# EAGLE design SalinityExpansion (EAGLE 6.4)
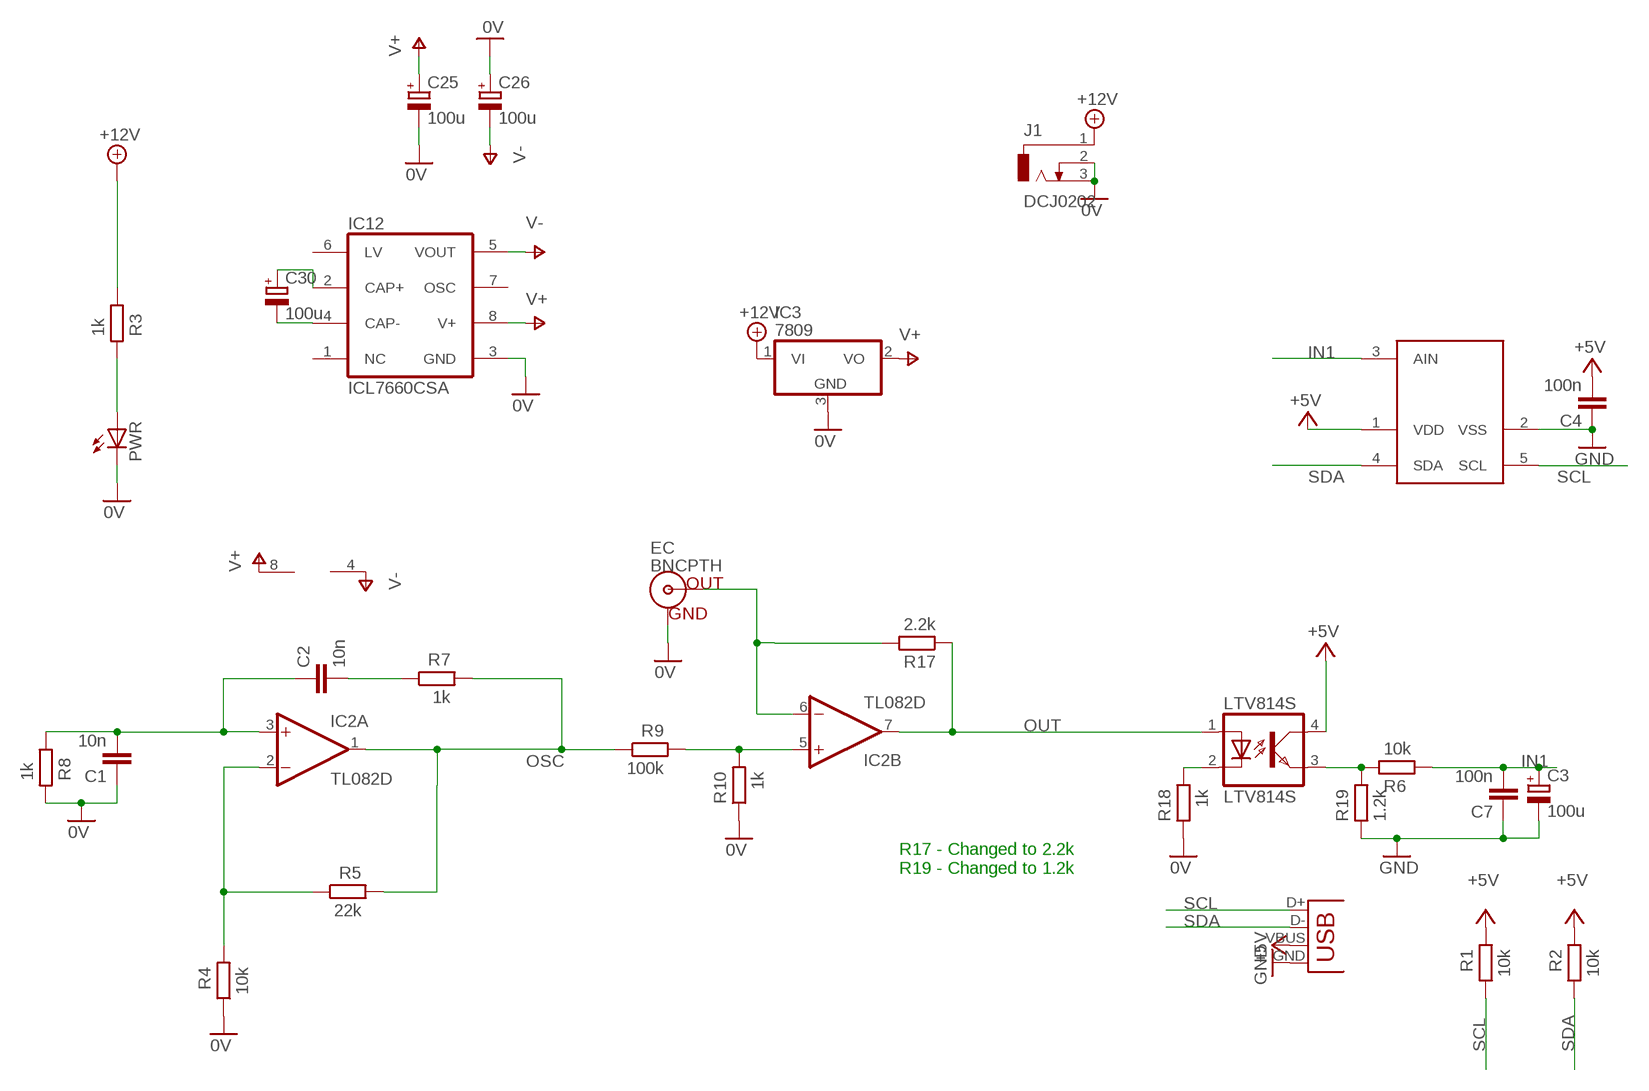
[diagram p0: schematic, sheet 1]

## Parts
C1  10n  C-EUC0805K  [C0805K]
C2  10n  C-EUC0805K  [C0805K]
C3  100u  CPOL-EUD  [PANASONIC_D]
C4  100n  C-EUC0805K  [C0805K]
C7  100n  C-EUC0805K  [C0805K]
C25  100u  CPOL-EUD  [PANASONIC_D]
C26  100u  CPOL-EUD  [PANASONIC_D]
C30  100u  CPOL-EUD  [PANASONIC_D]
EC  BNCPTH  [BNC]
IC2  TL082D  [SO08]
IC3  7809  7805DT  [TO252]
IC12  ICL7660CSA  [SO08]
J1  DCJ0202  [DCJ0202]
LTV814S  LTV814S  LTV816S  [SMD4]
PWR  LED3MM  [LED3MM]
R1  10k  R-EU_R0805  [R0805]
R2  10k  R-EU_R0805  [R0805]
R3  1k  R-EU_R0805  [R0805]
R4  10k  R-EU_R0805  [R0805]
R5  22k  R-EU_R0805  [R0805]
R6  10k  R-EU_R0805  [R0805]
R7  1k  R-EU_R0805  [R0805]
R8  1k  R-EU_R0805  [R0805]
R9  100k  R-EU_R0805  [R0805]
R10  1k  R-EU_R0805  [R0805]
R17  2.2k  R-EU_R0805  [R0805]
R18  1k  R-EU_R0805  [R0805]
R19  1.2k  R-EU_R0805  [R0805]
U$2  MCP3221  [SOT23-5]
X5  USBSMD  [USB-MINIB]

## Nets
0V: C1.1 C25.- C26.+ EC.GND IC3.3(GND) IC12.3(GND) J1.2 J1.3 PWR.K(C) R4.1 R8.2 R10.1 R18.1
+5V: C4.2 LTV814S.4(COL) R1.2 R2.2 U$2.1(VDD) X5.VBUS
+12V: IC3.1(VI) J1.1 R3.1
GND [gnd]: C3.- C4.1 C7.1 R19.1 U$2.2(VSS) X5.GND
IN1: C3.+ C7.2 R6.1 U$2.3(AIN)
N$1: LTV814S.3(EMIT) R6.2 R19.2
N$4: IC2.2(A:-IN) R4.2 R5.1
N$8: IC2.5(B:+IN) R9.2 R10.2
N$9: C2.2 R7.1
N$10: PWR.A R3.2
N$11: EC.S(OUT) IC2.6(B:-IN) R17.2
N$12: C1.2 C2.1 IC2.3(A:+IN) R8.1
N$18: LTV814S.2(C) R18.2
N$42: C30.- IC12.4(CAP-)
N$43: C30.+ IC12.2(CAP+)
OSC: IC2.1(A:OUT) R5.2 R7.2 R9.1
OUT: IC2.7(B:OUT) LTV814S.1(A) R17.1
SCL: R1.1 U$2.5(SCL) X5.D+
SDA: R2.1 U$2.4(SDA) X5.D-
V+: C25.+ IC2.8(P:V+) IC3.2(VO) IC12.8(V+)
V-: C26.- IC2.4(P:V-) IC12.5(VOUT)
Unconnected: IC12.1(NC) IC12.6(LV) IC12.7(OSC)

## Notes on the sheet
- R17 - Changed to 2.2k
  R19 - Changed to 1.2k

## Library data of the parts
C1 C2 C4 C7 = rcl:C-EU: CAPACITOR, European symbol
C3 C25 C26 C30 = rcl:CPOL-EU: POLARIZED CAPACITOR, European symbol
EC = SparkFun:BNC: BNC Connector, Mouser Part# 5227161
IC2 = linear:TL082: OP AMP
IC3 = adafruit:78*: Positive VOLTAGE REGULATOR Added bigger pads to the TO-92 package
IC12 = maxim:ICL7660CSA: VOLTAGE CONVERTER; MF: MAXIM; MPN: ICL7660CSA; OC_FARNELL: 9724710; OC_NEWARK: 34C3732
J1 = con-jack:DCJ0202: DC POWER JACK Source: DCJ0202.pdf; OC_FARNELL: unknown; OC_NEWARK: unknown
LTV814S = optocoupler:LTV816: OPTO COUPLER Source: LITEON, LTV816.pdf; OC_FARNELL: unknown; OC_NEWARK: unknown
PWR = led:LED: LED OSRAM: - CHIPLED LG R971, LG N971, LY N971, LG Q971, LY Q971, LO R971, LY R971 LH N974, LH R974 LS Q976, LO Q976, LY Q976 LO Q996 - Hyper CHIPLED LW Q18S LB Q993, LB Q99A, LB R99A - SideLED LS A670, LO A670, LY A670, LG A670, LP A670 LB A673, LV A673, LT A673, LW A673 LH A674 LY A675 LS A676, LA A676, LO A676, LY A676, LW A676 LS A679, LY A679, LG A679 - Hyper Micro SIDELED® LS Y876, LA Y876, LO Y876, LY Y876 LT Y87S - SmartLED LW L88C, LW L88S LB L89C, LB L89S, LG L890 LS L89K, LO L89K, LY L89K LS L896, LA L896, LO L896, LY L896 - TOPLED LS T670, LO T670, LY T670, LG T670, LP T670 LSG T670, LSP T670, LSY T670, LOP T670, LYG T670 LG T671, LOG T671, LSG T671 LB T673, LV T673, LT T673, LW T673 LH T674 LS T676, LA T676, LO T676, LY T676, LB T676, LH T676, LSB T676, LW T676 LB T67C, LV T67C, LT T67C, LS T67K, LO T67K, LY T67K, LW E67C LS E67B, LA E67B, LO E67B, LY E67B, LB E67C, LV E67C, LT E67C LW T67C LS T679, LY T679, LG T679 LS T770, LO T770, LY T770, LG T770, LP T770 LB T773, LV T773, LT T773, LW T773 LH T774 LS E675, LA E675, LY E675, LS T675 LS T776, LA T776, LO T776, LY T776, LB T776 LHGB T686 LT T68C, LB T68C - Hyper Mini TOPLED® LB M676 - Mini TOPLED Santana® LG M470 LS M47K, LO M47K, LY M47K Source: http://www.osram.convergy.de LUXEON: - LUMILED® LXK2-PW12-R00, LXK2-PW12-S00, LXK2-PW14-U00, LXK2-PW14-V00 LXK2-PM12-R00, LXK2-PM12-S00, LXK2-PM14-U00 LXK2-PE12-Q00, LXK2-PE12-R00, LXK2-PE12-S00, LXK2-PE14-T00, LXK2-PE14-U00 LXK2-PB12-K00, LXK2-PB12-L00, LXK2-PB12-M00, LXK2-PB14-N00, LXK2-PB14-P00, LXK2-PB14-Q00 LXK2-PR12-L00, LXK2-PR12-M00, LXK2-PR14-Q00, LXK2-PR14-R00 LXK2-PD12-Q00, LXK2-PD12-R00, LXK2-PD12-S00 LXK2-PH12-R00, LXK2-PH12-S00 LXK2-PL12-P00, LXK2-PL12-Q00, LXK2-PL12-R00 Source: www.luxeon.com KINGBRIGHT: KA-3528ASYC Source: www.kingbright.com
R1-R10 R17-R19 = rcl:R-EU_: RESISTOR, European symbol
U$2 = MCP3426:MCP3221
X5 = SparkFun:USB: USB Connectors USB-B-PTH is fully proven SKU : PRT-00139 USB-miniB is fully proven SKU : PRT-00587 USB-A-PCB is untested. USB-A-H is throughly reviewed, but untested. Spark Fun Electronics SKU : PRT-00437 USB-B-SMT is throughly reviewed, but untested. Needs silkscreen touching up. USB-A-S has not been used/tested USB-MB-H has not been used/tested

## Net classes
0 default: width 0.305 mm, drill 0.305 mm, clearance 0.203 mm
1 power: width 0.254 mm, drill 0.254 mm, clearance 0.229 mm
2 gnd: width 0.305 mm, drill 0.508 mm, clearance 0.203 mm

## Board
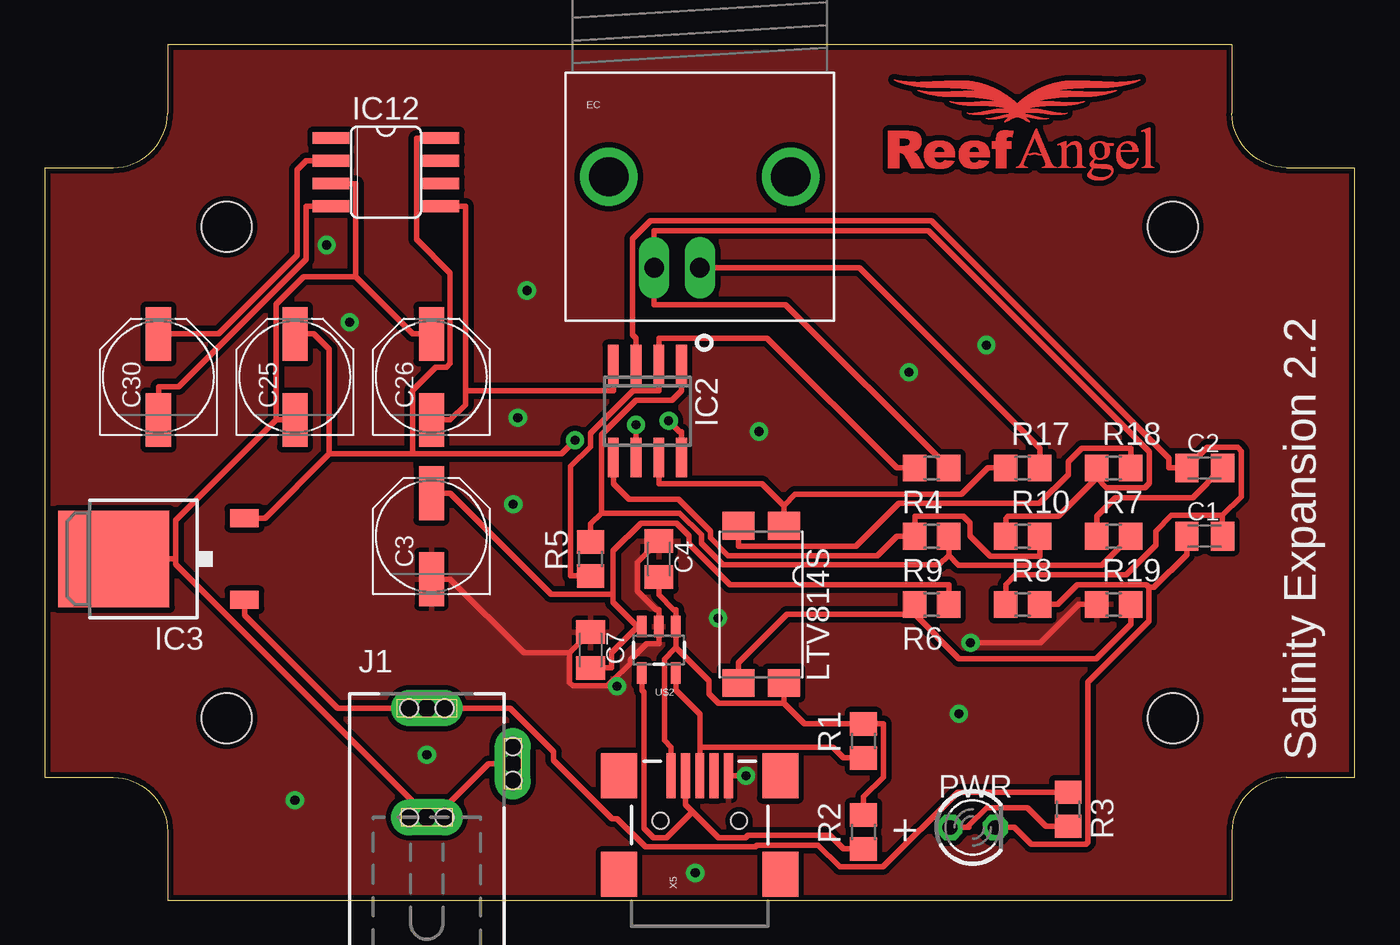
[diagram p1: board, top side]
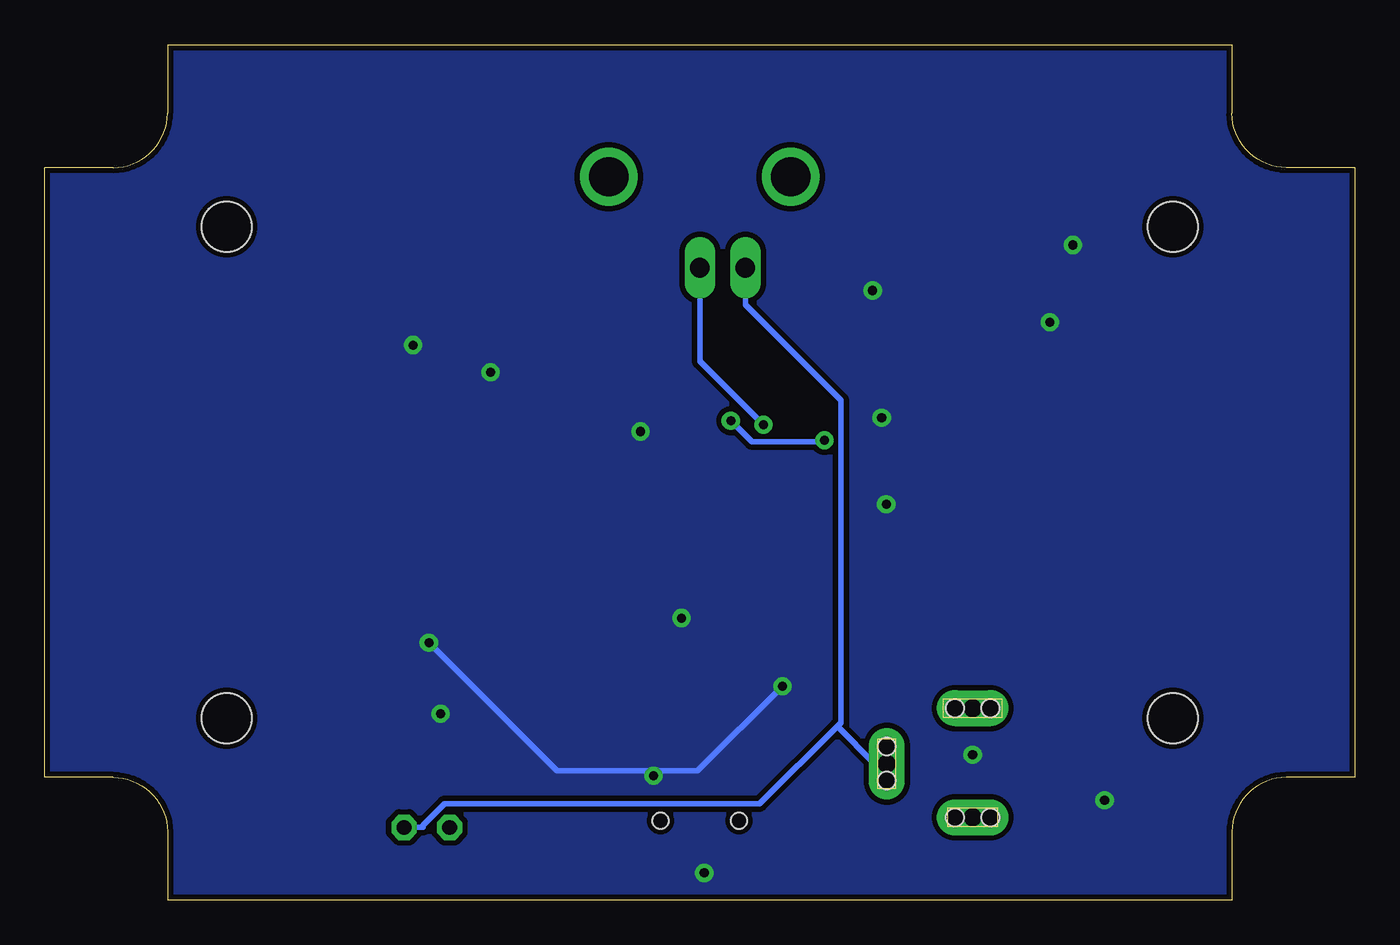
[diagram p2: board, bottom side, seen from below]

Size 73.15 x 47.75 mm. Coordinates in mm from the lower left corner, seen from the top.
Outline: 0,40.89 0,6.86 3.81,6.86 arc-90 6.86,3.81 6.86,0 66.29,0 66.29,3.81 arc-90 69.34,6.86 73.15,6.86 73.15,40.89 69.34,40.89 arc-90 66.29,43.94 66.29,47.75 6.86,47.75 6.86,43.94 arc-90 3.81,40.89 0,40.89
Copper layers (1*16): Top 0.035mm / dielectric 1.5mm / Bottom 0.035mm
Design rules "default": minimum track width 8mil, minimum drill 20mil, track to track 8mil, track to pad 8mil, pad to pad 8mil, via to via 8mil, smd to smd 8mil, copper to edge 10mil, drill to drill 8mil, minimum pad ring 12mil, minimum via ring 10mil, stop-mask expansion 4mil, vias tented up to drill 25mil, thermal gap 10mil
Holes 2.8 mm at 10.16,10.16 10.16,37.59 62.99,37.59 62.99,10.16

### Footprints (pad centres in the part's own frame; a part is rotated, then mirrored left to right if it is on the bottom)
C0805K = smd 1.3 x 1.6: 1 -1,0; 2 1,0
PANASONIC_D = smd 3 x 1.4: + 2.4,0; - -2.4,0
BNC = drill 2.2: 3 -5.08,5.08; 4 5.08,5.08 | drill 1.1 long: GND -2.54,0; S 0,0
SO08 = smd 0.6 x 2.2: 1 -1.905,-2.6; 2 -0.635,-2.6; 3 0.635,-2.6; 4 1.905,-2.6; 5 1.905,2.6; 6 0.635,2.6; 7 -0.635,2.6; 8 -1.905,2.6
TO252 = smd 1 x 1.6: 1 -2.28,-4.8; 2 2.28,-4.8 | smd 5.4 x 6.2: 3 0,2.5
SO08' = smd 0.66 x 2.032: 1 -1.905,-3.073; 2 -0.635,-3.073; 3 0.635,-3.073; 4 1.905,-3.073; 5 1.905,3.073; 6 0.635,3.073; 7 -0.635,3.073; 8 -1.905,3.073
DCJ0202 = drill 1 pad 2 long: 1 0,3.1; 2 4.8,0; 3 0,-3 | hole 1: 0.991,-2.997; -0.991,-2.997; 4.801,-0.94; 4.801,0.965; 0.991,3.099; -0.991,3.099
SMD4 = smd 1.78 x 1.55: 1 -1.27,-4.389; 2 1.27,-4.389; 3 1.27,4.389; 4 -1.27,4.389
LED3MM = drill 0.813 octagon: A -1.27,0; K 1.27,0
R0805 = smd 1.3 x 1.5: 1 -0.95,0; 2 0.95,0
SOT23-5 = smd 0.55 x 1.2: 1 -0.95,-1.3; 2 0,-1.3; 3 0.95,-1.3; 4 0.95,1.3; 5 -0.95,1.3
USB-MINIB = smd 2.5 x 0.5: D+ 2.5,0; D- 2.5,0.8; GND 2.5,-1.6; ID 2.5,-0.8; VBUS 2.5,1.6 | smd 2.5 x 2: GND@1 -3,-4.5; GND@2 -3,4.5; GND@3 2.5,4.5; GND@4 2.5,-4.5 | hole 0.9: 0,2.2; 0,-2.2

### Placement (x,y rotation side)
C1  64.77,20.32 0 top
C2  64.77,24.13 0 top
C3  21.59,20.32 90 top
C4  34.29,19.05 270 top
C7  30.48,13.97 270 top
C25  13.97,29.21 90 top
C26  21.59,29.21 90 top
C30  6.35,29.21 90 top
EC  36.58,35.31 0 top
IC2  33.66,27.3 180 top
IC3  6.35,19.05 90 top
IC12  ICL7660CSA  [SO08']  19.05,40.64 270 top
J1  21.34,7.62 0 top
LTV814S  40.01,16.51 180 top
PWR  51.82,4.06 0 top
R1  45.72,8.89 90 top
R2  45.72,3.81 90 top
R3  57.15,5.08 270 top
R4  49.53,24.13 180 top
R5  30.48,19.05 90 top
R6  49.53,16.51 180 top
R7  59.69,20.32 0 top
R8  54.61,16.51 0 top
R9  49.53,20.32 180 top
R10  54.61,20.32 0 top
R17  54.61,24.13 0 top
R18  59.69,24.13 0 top
R19  59.69,16.51 0 top
U$2  34.29,13.97 180 top
X5  36.58,4.45 90 top

### Tracks (layer width: path | path; a pad name or v marks a point on that pad's centre or on a via)
0V
  Top 0.305: 58.74,23.58 59.29,23.02 61.44,23.02 61.69,23.28 61.69,25.03 49.35,37.37 34.04,37.37 EC.GND 34.04,33.24 41.37,33.24 R4.1 | 58.74,23.58 56.59,21.43 53.79,21.43 53.66,21.3 R10.1 | 17.35,34.8 20.53,31.61 C26.+ | 17.35,34.8 17.35,40.01 IC12.3 | 17.35,34.8 14.45,34.8 12.91,33.26 12.91,26.81 | C25.- 12.91,26.81 | 7.31,19.05 7.31,21.2 12.91,26.81 | 21.34,5.3 20.76,5.3 7.31,18.75 7.31,19.05 | R18.1 58.74,23.58 | 21.34,5.3 22.46,5.3 24.78,7.62 J1.2 | IC3.3 7.31,19.05 | J1.3 21.34,5.3 | 61.66,17.46 61.94,17.46 63.77,19.29 C1.1 | R8.2 56.57,16.51 57.67,17.62 61.51,17.62 61.66,17.46 | 61.66,17.46 61.66,15.58 58.26,12.18 58.26,3.25 58.13,3.12 55.09,3.12 54.15,4.06 PWR.K
  Bottom 0.305: 28.9,9.71 33.23,5.37 50.82,5.37 52.02,4.17 52.02,4.06 PWR.K | 28.9,9.71 28.69,9.91 28.69,27.9 34.04,33.24 EC.GND | 28.9,9.71 26.81,7.62 J1.2
+5V
  Top 0.305: C4.2 34.29,17.04 35.11,16.23 35.24,16.23 U$2.1 35.24,14.79 35.24,14.31 35.24,14.03 | R2.2 45.72,5.77 46.83,6.87 46.83,9.84 R1.2 42.42,9.84 41.27,10.99 | 35.24,14.03 35.3,14.03 37.08,12.24 37.08,11.54 37.63,10.99 41.27,10.99 | 35.24,14.03 35.17,14.03 34.6,13.46 34.6,8.92 34.98,8.55 X5.VBUS | LTV814S.4 41.27,10.99
+12V
  Top 0.305: IC3.1 11.15,15.91 16.34,10.72 J1.1 25.97,10.72 28.42,8.27 28.42,7.8 31.66,4.55 31.96,4.55 33.54,2.98 39.69,2.98 39.78,3.08 43.19,3.08 44.41,1.85 46.8,1.85 50.98,6.03 R3.1
GND  (via drill 0.51 pad 1.02)
  Top 0.305: v31.96,11.95 31.69,12.22 | 31.69,12.22 31.44,11.96 29.5,11.96 29.32,12.15 29.32,13.8 | 31.69,12.22 32.71,13.24 32.71,13.42 33.61,14.31 34.29,14.31 U$2.2 34.29,16.23 34.13,16.23 33.11,17.25 33.11,18.87 C4.1 | 29.32,13.8 C7.1 | 29.32,13.8 26.76,13.8 22.65,17.92 C3.- | X5.GND v39.15,6.95 | v51.7,14.37 55.59,14.37 57.73,16.51 R19.1
  Bottom 0.305: 39.15,7.22 36.69,7.22 v31.96,11.95 | v51.7,14.37 44.55,7.22 39.15,7.22 | 39.15,7.22 v39.15,6.95
  other vias: 26.92,34.04 13.97,5.59 21.34,8.13 26.16,22.1 17.02,32.26 15.75,36.58 39.88,26.16 48.26,29.46 52.58,30.99 51.05,10.41 36.32,1.52 26.42,26.92 37.59,15.75
  pour Bottom (isolate 0.305): 0,0 0,48.01 73.66,48.01 73.66,0
  pour Top (isolate 0.305): 0,0 0,48.01 73.66,48.01 73.66,0
IN1
  Top 0.305: 33.1,15.27 31.64,13.8 31.64,12.97 C7.2 | U$2.3 33.1,15.27 | 33.1,15.27 31.74,16.63 31.74,17.08 | 31.74,17.08 31.74,19.5 33.3,21.06 35.28,21.06 35.98,20.36 35.98,19.9 38.27,17.62 50.48,17.62 R6.1 | 31.74,17.08 28.29,17.08 22.65,22.72 C3.+
N$1
  Top 0.305: R19.2 60.64,15.4 58.71,13.47 51.06,13.47 48.58,15.96 | LTV814S.3 38.73,13.25 41.44,15.96 48.58,15.96 | R6.2 48.58,15.96
N$4
  Top 0.305: R4.2 47.57,24.13 40.34,31.36 34.29,31.36 IC2.2 34.29,29.3 34.29,28.45 32.84,28.45 30.47,26.08 30.47,25.32 29.37,24.22 29.37,18.1 R5.1
N$8
  Top 0.305: R10.2 55.56,19.21 52.8,19.21 51.65,20.36 51.65,21.06 51.29,21.43 48.58,21.43 R9.2 47.57,20.32 46.49,19.24 38.16,19.24 37.18,20.23 37.18,20.6 35.4,22.37 32.63,22.37 31.75,23.25 IC2.5
N$9
  Top 0.305: R7.1 58.74,21.43 59.78,22.47 64.11,22.47 C2.2
N$10
  Top 0.305: PWR.A 51.61,4.06 51.61,4.17 52.6,5.16 54.88,5.16 55.91,4.13 R3.2
N$11  (via drill 0.51 pad 1.02)
  Top 0.305: R17.2 55.56,25.24 45.49,35.31 EC.S | v33.02,26.53 IC2.6
  Bottom 0.305: EC.S 36.58,30.09 v33.02,26.53
N$12
  Top 0.305: 65.77,21.48 62.91,21.48 62.05,20.61 62.05,19.82 60.39,18.17 54.21,18.17 53.66,17.62 R8.1 | 65.77,21.48 66.82,22.53 66.82,25.07 66.61,25.29 64.93,25.29 C2.1 62.76,24.13 62.76,24.68 49.52,37.93 33.82,37.93 32.81,36.91 32.81,31.57 33.02,31.36 IC2.3 | C1.2 65.77,21.48
N$18
  Top 0.305: LTV814S.2 38.73,19.77 45.31,19.77 47.69,22.15 55.55,22.15 57.15,23.75 57.15,24.48 57.91,25.24 60.64,25.24 R18.2
N$42
  Top 0.305: C30.- 6.35,28.67 7.49,28.67 14.61,35.78 14.61,38.73 IC12.4
N$43
  Top 0.305: IC12.2 14.61,41.27 14.1,40.77 14.1,35.99 9.71,31.61 C30.+
OSC
  Top 0.305: R7.2 59.03,18.71 51.03,18.71 50.48,19.26 | 31.09,21.61 35.45,21.61 36.67,20.39 36.67,19.94 37.89,18.72 49.95,18.72 50.48,19.26 | 31.09,21.61 30.48,21.01 R5.2 | 31.09,21.61 31.09,25.97 33.03,27.92 35.03,27.92 35.56,28.45 IC2.1 | R9.1 50.48,19.26
OUT
  Top 0.305: R17.1 52.65,24.13 51.18,22.66 41.9,22.66 41.27,22.03 | IC2.7 34.29,23.25 40.05,23.25 41.27,22.03 | 41.27,22.03 41.27,21.9 LTV814S.1
SCL
  Top 0.305: U$2.5 35.24,11.71 36.58,10.38 36.58,8.55 | R1.1 44.61,7.94 44,8.55 36.58,8.55 | X5.D+ 36.58,8.55
SDA
  Top 0.305: 36.17,4.94 34.72,3.49 33.99,3.49 33.45,4.03 33.45,11.6 33.34,11.71 U$2.4 | 36.17,4.94 37.63,3.49 39.13,3.49 39.27,3.62 43.85,3.62 44.61,2.86 R2.1 | 36.17,4.94 35.78,5.34 X5.D-
V+  (via drill 0.51 pad 1.02)
  Top 0.305: 15.89,24.91 20.53,24.91 | 15.89,24.91 12.31,21.33 IC3.2 | 15.89,24.91 15.89,30.75 15.03,31.61 C25.+ | IC12.8 20.75,42.55 20.75,36.89 22.65,34.99 22.65,29.96 22.44,29.75 21.81,29.75 20.53,28.48 20.53,24.91 | 20.53,24.91 28.85,24.91 v29.61,25.67 | IC2.8 35.56,26.16 35.45,26.16 v34.84,26.77
  Bottom 0.305: v29.61,25.67 29.69,25.59 33.66,25.59 v34.84,26.77
V-
  Top 0.305: 23.5,28.45 23.5,27.66 22.65,26.81 C26.- | 23.5,28.45 23.5,38.73 IC12.5 | 23.5,28.45 31.75,28.45 IC2.4
(copper drawn outside any net)
  shapes: Top area x2966

### Text on the board
tPlace: Salinity Expansion 2.2
tNames: +